# Altium schematic sheet mbed_main_board.SchDoc
size A4
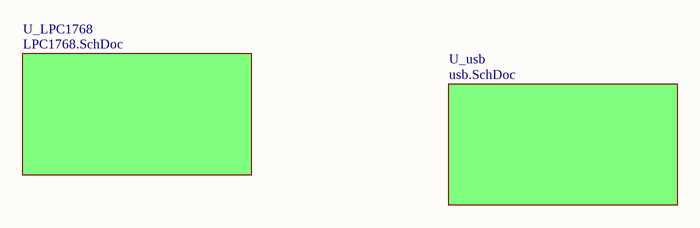
[diagram p0: mbed_main_board.SchDoc]

## Sub-sheets
U_LPC1768 = LPC1768.SchDoc: no entries
U_usb = usb.SchDoc: no entries